# Altium schematic sheet Jacks.SchDoc
size 215 x 165 mm; SheetNumber: 6; SheetTotal: 7
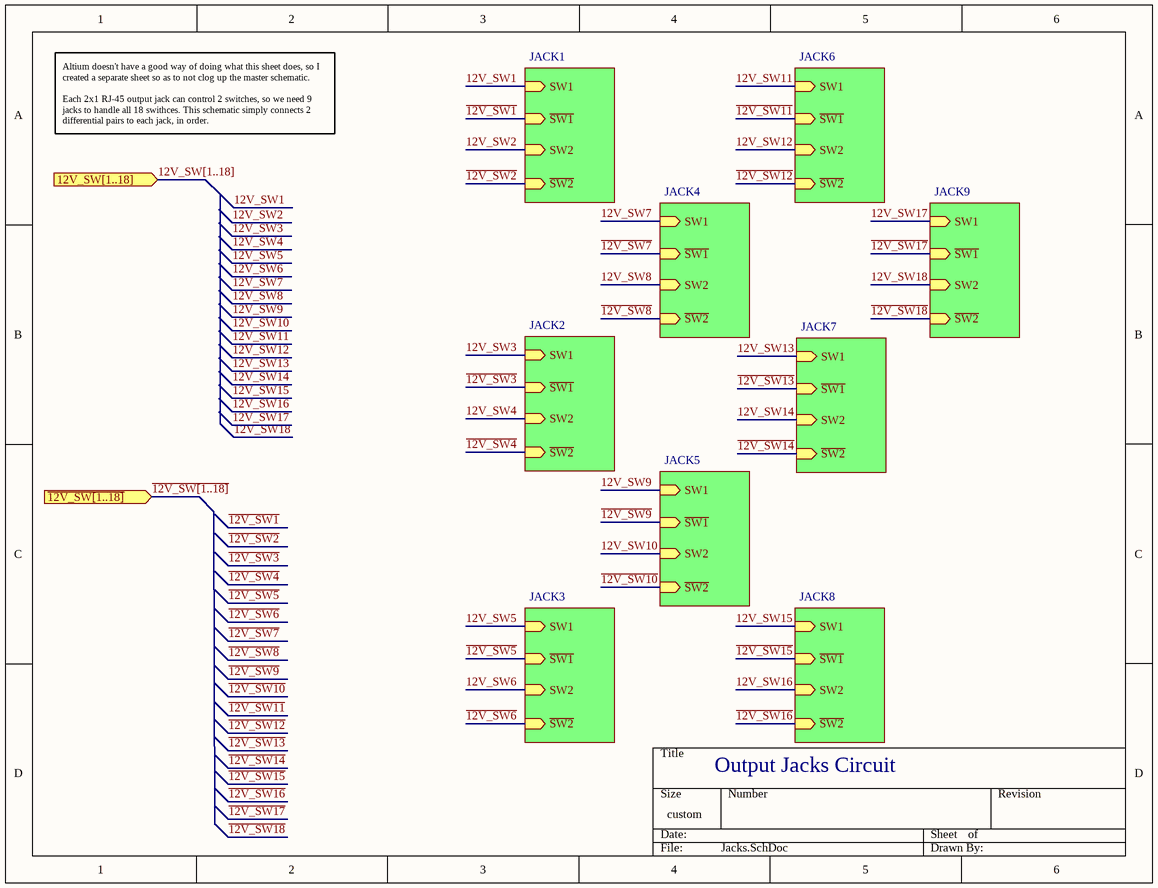
[diagram p0: Jacks.SchDoc]

## Sub-sheets
JACK1 = Jack.SchDoc: SW1 (in), ~{SW1} (in), SW2 (in), ~{SW2} (in)
JACK2 = Jack.SchDoc: SW1 (in), ~{SW1} (in), SW2 (in), ~{SW2} (in)
JACK3 = Jack.SchDoc: SW1 (in), ~{SW1} (in), SW2 (in), ~{SW2} (in)
JACK4 = Jack.SchDoc: SW1 (in), ~{SW1} (in), SW2 (in), ~{SW2} (in)
JACK5 = Jack.SchDoc: SW1 (in), ~{SW1} (in), SW2 (in), ~{SW2} (in)
JACK6 = Jack.SchDoc: SW1 (in), ~{SW1} (in), SW2 (in), ~{SW2} (in)
JACK7 = Jack.SchDoc: SW1 (in), ~{SW1} (in), SW2 (in), ~{SW2} (in)
JACK8 = Jack.SchDoc: SW1 (in), ~{SW1} (in), SW2 (in), ~{SW2} (in)
JACK9 = Jack.SchDoc: SW1 (in), ~{SW1} (in), SW2 (in), ~{SW2} (in)

## Ports
12V_SW[1..18] (in, see Load_Bank_Master[4C], TX[4A], TX_GROUP[4B]), ~{12V_SW[1..18]} (in, see Load_Bank_Master[4C], TX[4B], TX_GROUP[4A])

## Nets
12V_SW1: sheet JACK1/SW1
12V_SW2: sheet JACK1/SW2
12V_SW3: sheet JACK2/SW1
12V_SW4: sheet JACK2/SW2
12V_SW5: sheet JACK3/SW1
12V_SW6: sheet JACK3/SW2
12V_SW7: sheet JACK4/SW1
12V_SW8: sheet JACK4/SW2
12V_SW9: sheet JACK5/SW1
12V_SW10: sheet JACK5/SW2
12V_SW11: sheet JACK6/SW1
12V_SW12: sheet JACK6/SW2
12V_SW13: sheet JACK7/SW1
12V_SW14: sheet JACK7/SW2
12V_SW15: sheet JACK8/SW1
12V_SW16: sheet JACK8/SW2
12V_SW17: sheet JACK9/SW1
12V_SW18: sheet JACK9/SW2
~{12V_SW1}: sheet JACK1/~{SW1}
~{12V_SW2}: sheet JACK1/~{SW2}
~{12V_SW3}: sheet JACK2/~{SW1}
~{12V_SW4}: sheet JACK2/~{SW2}
~{12V_SW5}: sheet JACK3/~{SW1}
~{12V_SW6}: sheet JACK3/~{SW2}
~{12V_SW7}: sheet JACK4/~{SW1}
~{12V_SW8}: sheet JACK4/~{SW2}
~{12V_SW9}: sheet JACK5/~{SW1}
~{12V_SW10}: sheet JACK5/~{SW2}
~{12V_SW11}: sheet JACK6/~{SW1}
~{12V_SW12}: sheet JACK6/~{SW2}
~{12V_SW13}: sheet JACK7/~{SW1}
~{12V_SW14}: sheet JACK7/~{SW2}
~{12V_SW15}: sheet JACK8/~{SW1}
~{12V_SW16}: sheet JACK8/~{SW2}
~{12V_SW17}: sheet JACK9/~{SW1}
~{12V_SW18}: sheet JACK9/~{SW2}

## Buses and harness runs
bus 12V_SW[1..18] = port 12V_SW[1..18]
bus ~{12V_SW[1..18]} = port ~{12V_SW[1..18]}

## Notes on the sheet
- Altium doesn't have a good way of doing what this sheet does, so I created a separate sheet so as to not clog up the master schematic.
  Each 2x1 RJ-45 output jack can control 2 switches, so we need 9 jacks to handle all 18 swithces. This schematic simply connects 2 differential pairs to each jack, in order.
- Output Jacks Circuit